# EAGLE schematic bias_board (EAGLE 6.4)

## Sheet 1 of 5: PI_Conn_Isolation
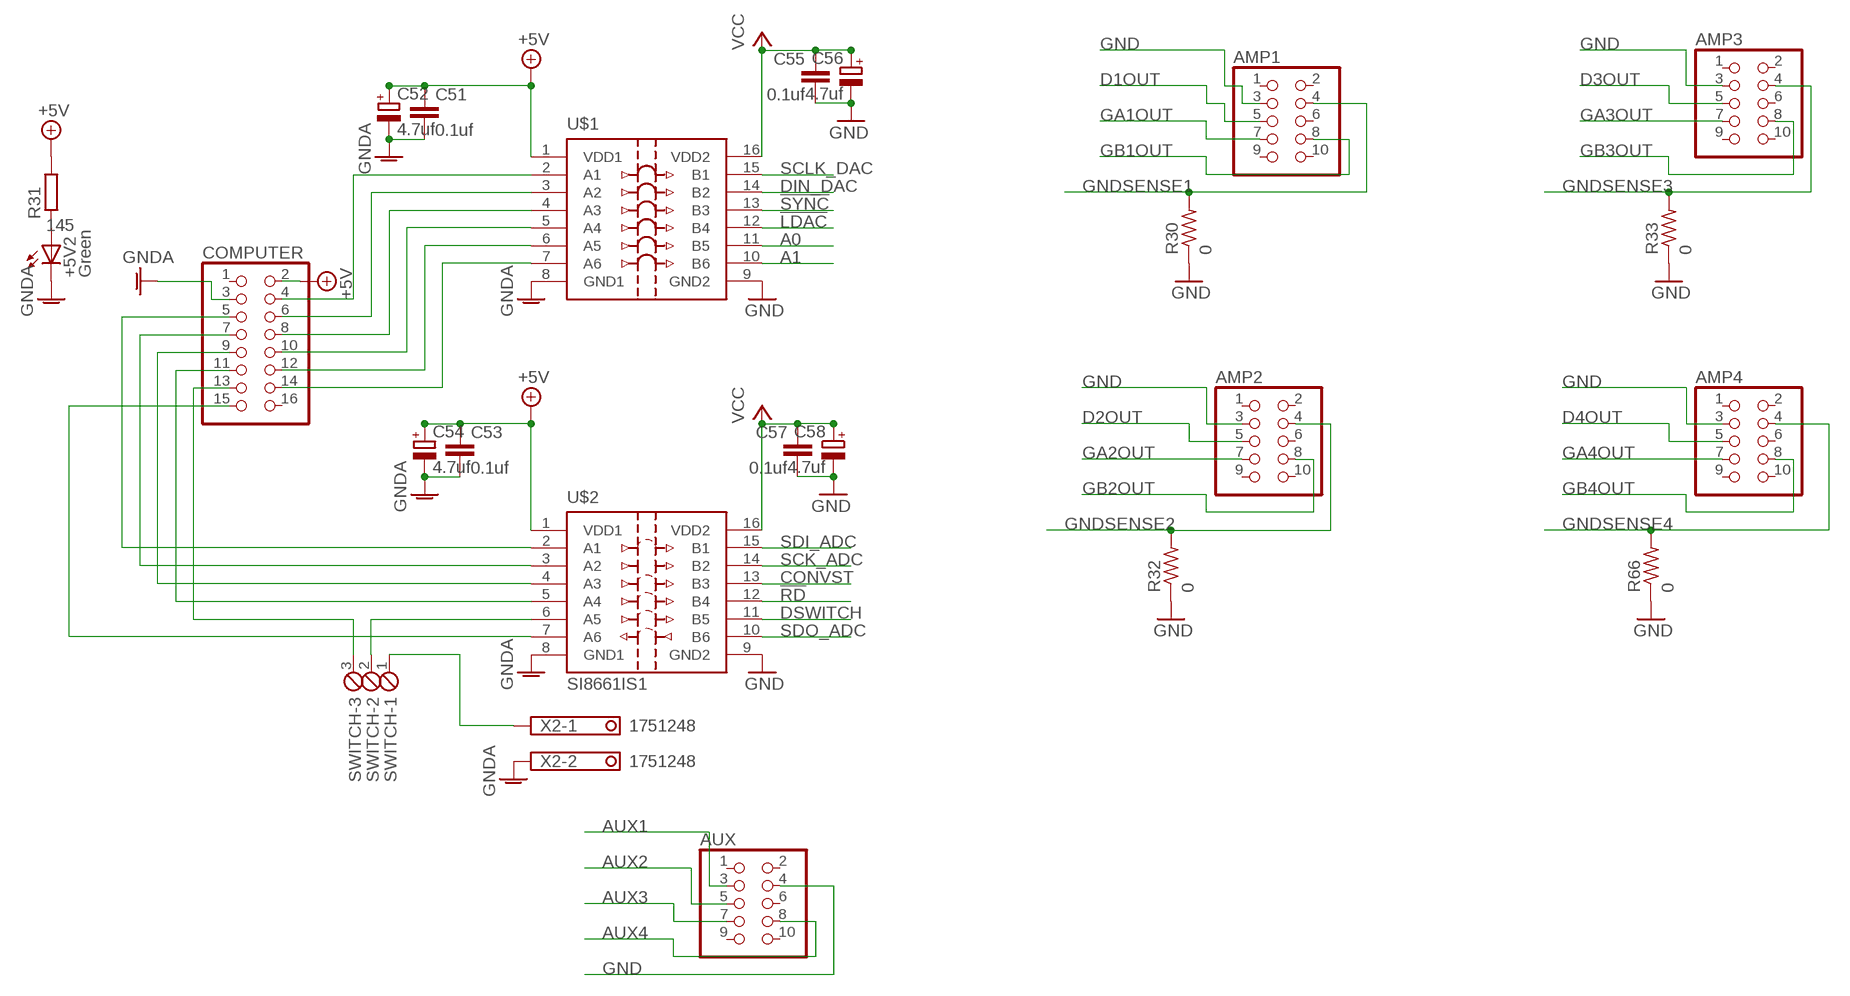
[diagram p0: schematic, sheet 1]

### Parts
+5V2  Green  LEDSMT1206  [1206]
AMP1  PINHD-2X5  [2X05]
AMP2  PINHD-2X5  [2X05]
AMP3  PINHD-2X5  [2X05]
AMP4  PINHD-2X5  [2X05]
AUX  PINHD-2X5  [2X05]
C51  0.1uf  C-EUC1206  [C1206]
C52  4.7uf  CPOL-EUA/3216-18W  [A/3216-18W]
C53  0.1uf  C-EUC1206  [C1206]
C54  4.7uf  CPOL-EUA/3216-18W  [A/3216-18W]
C55  0.1uf  C-EUC1206  [C1206]
C56  4.7uf  CPOL-EUA/3216-18W  [A/3216-18W]
C57  0.1uf  C-EUC1206  [C1206]
C58  4.7uf  CPOL-EUA/3216-18W  [A/3216-18W]
COMPUTER  PINHD-2X8  [2X08]
R30  0  R-US_M1206  [M1206]
R31  145  R-EU_R1206  [R1206]
R32  0  R-US_M1206  [M1206]
R33  0  R-US_M1206  [M1206]
R66  0  R-US_M1206  [M1206]
SWITCH  MPT3  [3POL254]
U$1  SI8660IS1  [SO16]
U$2  SI8661IS1  [SO16]
X2  1751248  [1751248]

### Nets
!LDAC: U$1.12(B4) ; also sheet 3
!RD: U$2.12(B4) ; also sheet 3
!SYNC: U$1.13(B3) ; also sheet 3
+5V: C51.1 C52.+ C53.1 C54.+ COMPUTER.2 R31.2 U$1.1(VDD1) U$2.1(VDD1)
A0: U$1.11(B5) ; also sheet 5
A1: U$1.10(B6) ; also sheet 5
AUX1: AUX.3 ; also sheet 5
AUX2: AUX.5 ; also sheet 5
AUX3: AUX.7 ; also sheet 5
AUX4: AUX.8 ; also sheet 5
CONVST: U$2.13(B3) ; also sheet 3
D1OUT: AMP1.5 ; also sheet 4
D2OUT: AMP2.5 ; also sheet 4
D3OUT: AMP3.5 ; also sheet 4
D4OUT: AMP4.5 ; also sheet 4
DIN_DAC: U$1.14(B2) ; also sheet 3
DSWITCH: U$2.11(B5) ; also sheet 3
GA1OUT: AMP1.7 ; also sheet 4
GA2OUT: AMP2.7 ; also sheet 4
GA3OUT: AMP3.7 ; also sheet 4
GA4OUT: AMP4.7 ; also sheet 4
GB1OUT: AMP1.8 ; also sheet 4
GB2OUT: AMP2.8 ; also sheet 4
GB3OUT: AMP3.8 ; also sheet 4
GB4OUT: AMP4.8 ; also sheet 4
GND: AMP1.3 AMP2.3 AMP3.3 AMP4.3 AUX.4 C55.2 C56.- C57.2 C58.- R30.1 R32.1 R33.1 R66.1 U$1.9(GND2) U$2.9(GND2) ; also sheet 2,3,4,5
GNDA: +5V2.C C51.2 C52.- C53.2 C54.- COMPUTER.3 U$1.8(GND1) U$2.8(GND1) X2.2
GNDSENSE1: AMP1.4 R30.2 ; also sheet 5
GNDSENSE2: AMP2.4 R32.2 ; also sheet 5
GNDSENSE3: AMP3.4 R33.2 ; also sheet 5
GNDSENSE4: AMP4.4 R66.2 ; also sheet 5
N$2: COMPUTER.10 U$1.5(A4)
N$3: COMPUTER.12 U$1.6(A5)
N$18: COMPUTER.11 U$2.5(A4)
N$19: COMPUTER.4 U$1.2(A1)
N$20: COMPUTER.6 U$1.3(A2)
N$21: COMPUTER.8 U$1.4(A3)
N$22: COMPUTER.5 U$2.2(A1)
N$23: COMPUTER.7 U$2.3(A2)
N$24: COMPUTER.9 U$2.4(A3)
N$25: COMPUTER.13 SWITCH.3
N$29: COMPUTER.15 U$2.7(A6)
N$30: +5V2.A R31.1
N$31: SWITCH.2 U$2.6(A5)
N$32: SWITCH.1 X2.1
N$50: COMPUTER.14 U$1.7(A6)
SCK_ADC: U$2.14(B2) ; also sheet 3
SCLK_DAC: U$1.15(B1) ; also sheet 3
SDI_ADC: U$2.15(B1) ; also sheet 3
SDO_ADC: U$2.10(B6) ; also sheet 3
VCC: C55.1 C56.+ C57.1 C58.+ U$1.16(VDD2) U$2.16(VDD2) ; also sheet 2,3,5
Unconnected: AMP1.1 AMP1.2 AMP1.6 AMP1.9 AMP1.10 AMP2.1 AMP2.2 AMP2.6 AMP2.9 AMP2.10 AMP3.1 AMP3.2 AMP3.6 AMP3.9 AMP3.10 AMP4.1 AMP4.2 AMP4.6 AMP4.9 AMP4.10 AUX.1 AUX.2 AUX.6 AUX.9 AUX.10 COMPUTER.1 COMPUTER.16

## Sheet 2 of 5: Power
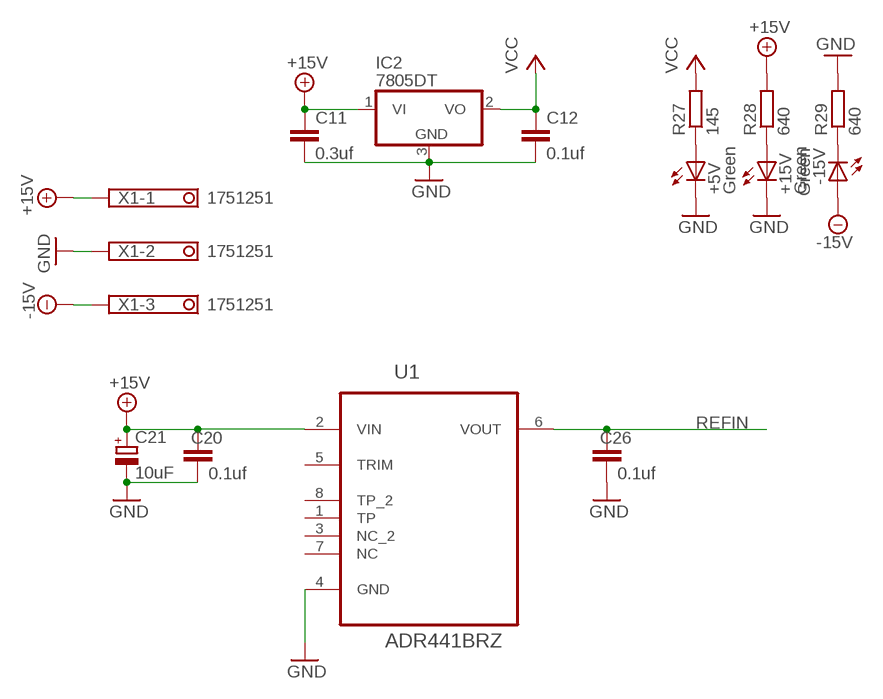
[diagram p1: schematic, sheet 2]

### Parts
+5V  Green  LEDSMT1206  [1206]
+15V  Green  LEDSMT1206  [1206]
-15V  Green  LEDSMT1206  [1206]
C11  0.3uf  C-EUC1206  [C1206]
C12  0.1uf  C-EUC1206  [C1206]
C20  0.1uf  C-EUC1206  [C1206]
C21  10uF  CPOL-EUA/3216-18W  [A/3216-18W]
C26  0.1uf  C-EUC1206  [C1206]
IC2  7805DT  [TO252]
R27  145  R-EU_R1206  [R1206]
R28  640  R-EU_R1206  [R1206]
R29  640  R-EU_R1206  [R1206]
U1  ADR441BRZ  [SOIC127P600X175-8N]
X1  1751251  [1751251]

### Nets
+15V: C11.1 C20.1 C21.+ IC2.1(VI) R28.2 U1.2(VIN) X1.1 ; also sheet 3,4,5
-15V: -15V.A X1.3 ; also sheet 3,4,5
GND: +5V.C +15V.C C11.2 C12.2 C20.2 C21.- C26.2 IC2.3(GND) R29.2 U1.4(GND) X1.2 ; also sheet 1,3,4,5
N$26: +5V.A R27.1
N$27: +15V.A R28.1
N$28: -15V.C R29.1
REFIN: C26.1 U1.6(VOUT) ; also sheet 3
VCC: C12.1 IC2.2(VO) R27.2 ; also sheet 1,3,5
Unconnected: U1.1(TP) U1.3(NC_2) U1.5(TRIM) U1.7(NC) U1.8(TP_2)

## Sheet 3 of 5: DAQ
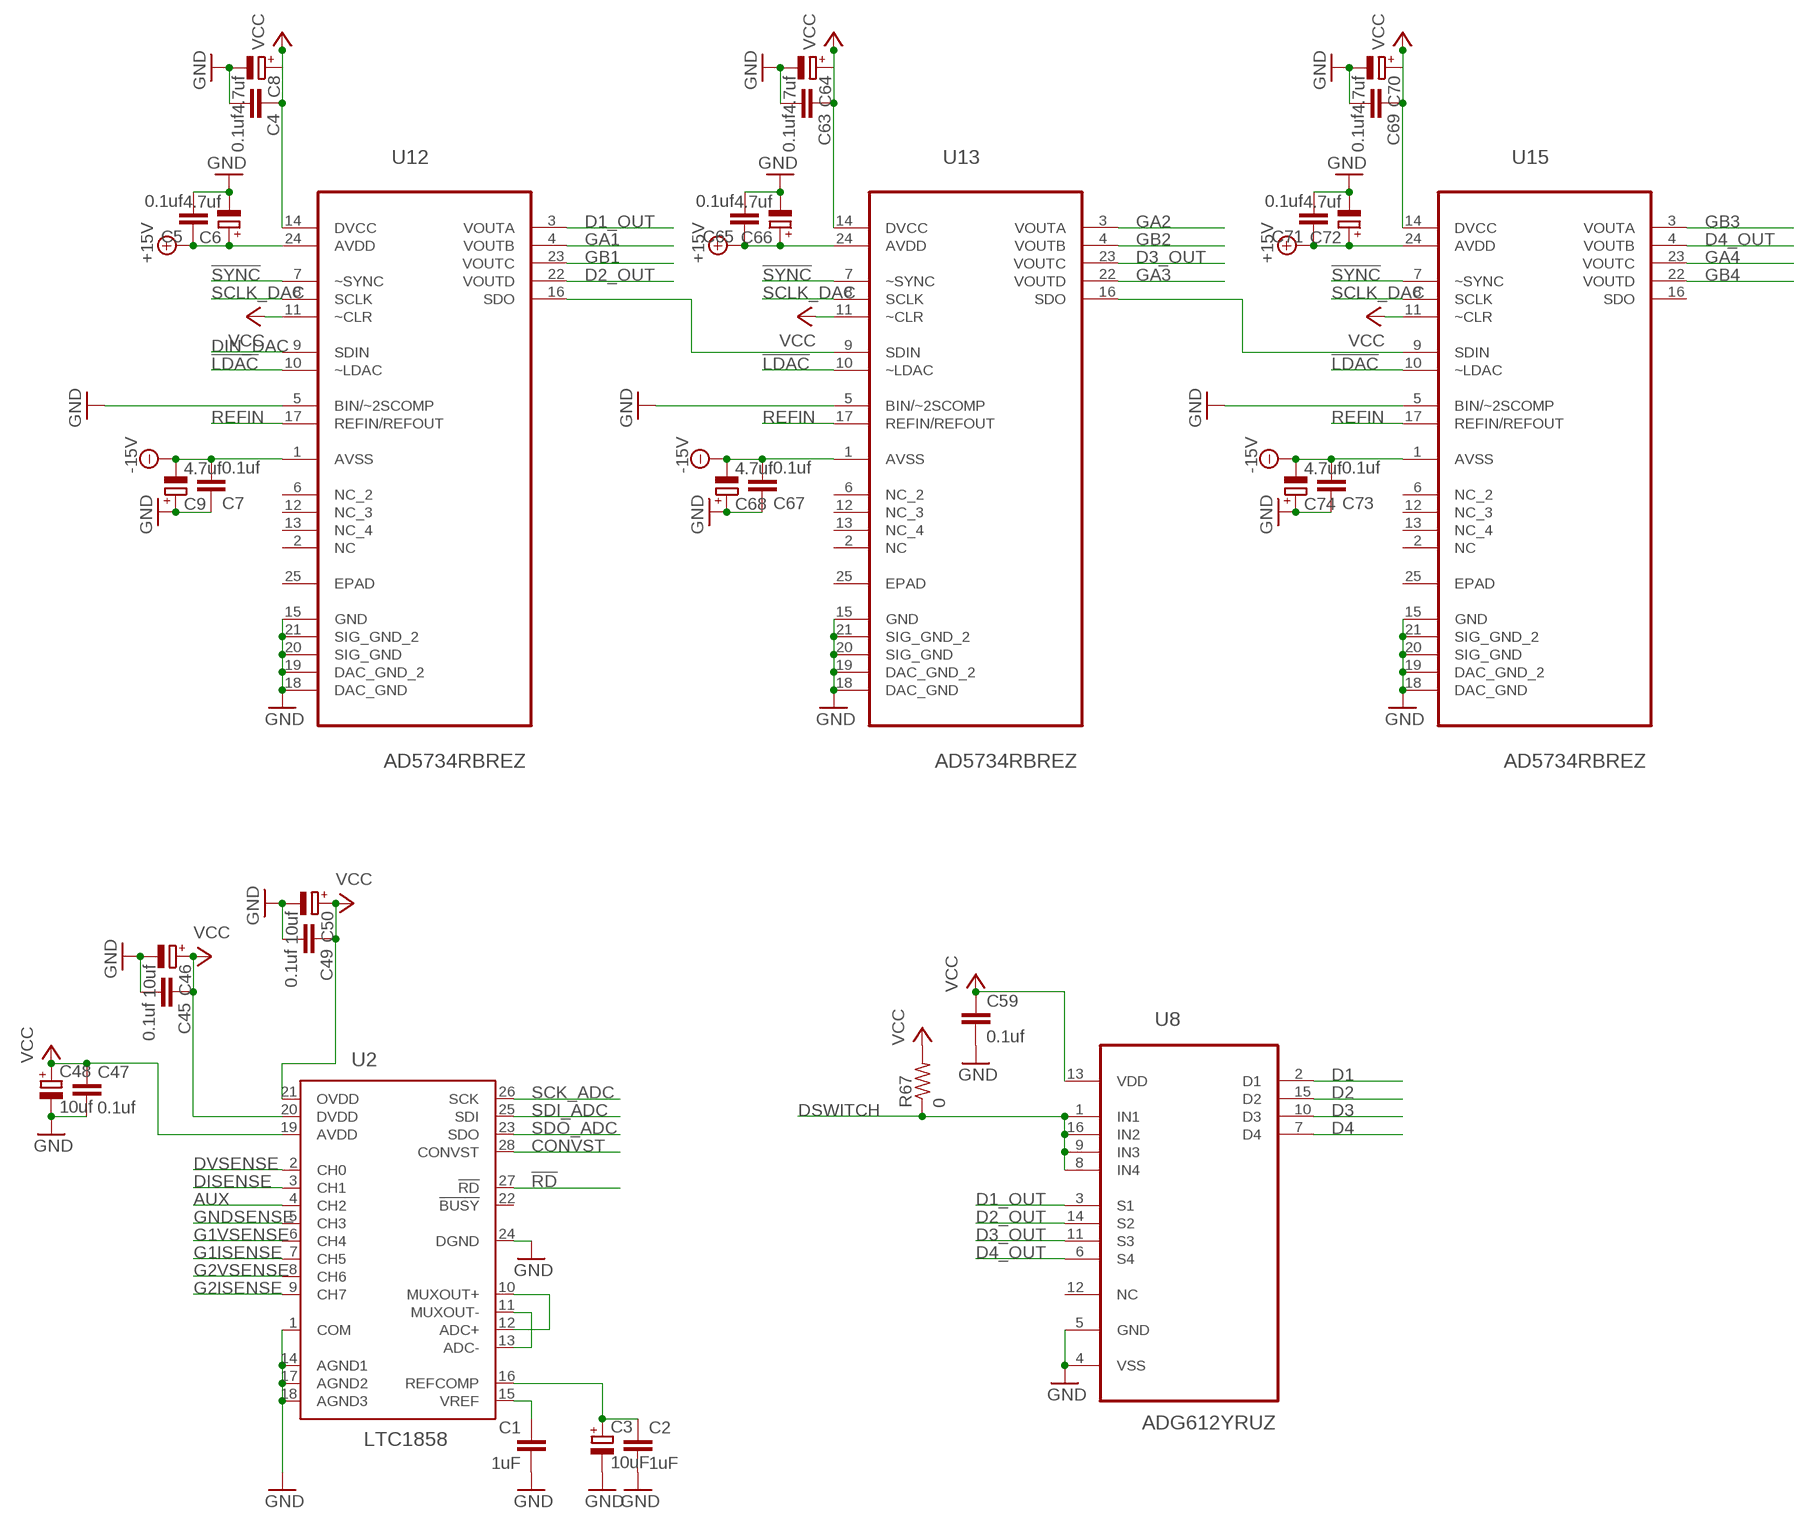
[diagram p2: schematic, sheet 3]

### Parts
C1  1uF  C-EUC1206  [C1206]
C2  1uF  C-EUC1206  [C1206]
C3  10uF  CPOL-EUA/3216-18W  [A/3216-18W]
C4  0.1uf  C-EUC1206  [C1206]
C5  0.1uf  C-EUC1206  [C1206]
C6  4.7uf  CPOL-EUA/3216-18W  [A/3216-18W]
C7  0.1uf  C-EUC1206  [C1206]
C8  4.7uf  CPOL-EUA/3216-18W  [A/3216-18W]
C9  4.7uf  CPOL-EUA/3216-18W  [A/3216-18W]
C45  0.1uf  C-EUC1206  [C1206]
C46  10uf  CPOL-EUA/3216-18W  [A/3216-18W]
C47  0.1uf  C-EUC1206  [C1206]
C48  10uf  CPOL-EUA/3216-18W  [A/3216-18W]
C49  0.1uf  C-EUC1206  [C1206]
C50  10uf  CPOL-EUA/3216-18W  [A/3216-18W]
C59  0.1uf  C-EUC1206  [C1206]
C63  0.1uf  C-EUC1206  [C1206]
C64  4.7uf  CPOL-EUA/3216-18W  [A/3216-18W]
C65  0.1uf  C-EUC1206  [C1206]
C66  4.7uf  CPOL-EUA/3216-18W  [A/3216-18W]
C67  0.1uf  C-EUC1206  [C1206]
C68  4.7uf  CPOL-EUA/3216-18W  [A/3216-18W]
C69  0.1uf  C-EUC1206  [C1206]
C70  4.7uf  CPOL-EUA/3216-18W  [A/3216-18W]
C71  0.1uf  C-EUC1206  [C1206]
C72  4.7uf  CPOL-EUA/3216-18W  [A/3216-18W]
C73  0.1uf  C-EUC1206  [C1206]
C74  4.7uf  CPOL-EUA/3216-18W  [A/3216-18W]
R67  0  R-US_M1206  [M1206]
U2  LTC1858  [SSOP28]
U8  ADG612YRUZ  [SOP65P640X120-16N]
U12  AD5734RBREZ  [SOP65P640X120-25N]
U13  AD5734RBREZ  [SOP65P640X120-25N]
U15  AD5734RBREZ  [SOP65P640X120-25N]

### Nets
!LDAC: U12.10(~LDAC) U13.10(~LDAC) U15.10(~LDAC) ; also sheet 1
!RD: U2.27(!RD) ; also sheet 1
!SYNC: U12.7(~SYNC) U13.7(~SYNC) U15.7(~SYNC) ; also sheet 1
+15V: C5.1 C6.+ C65.1 C66.+ C71.1 C72.+ U12.24(AVDD) U13.24(AVDD) U15.24(AVDD) ; also sheet 2,4,5
-15V: C7.2 C9.- C67.2 C68.- C73.2 C74.- U12.1(AVSS) U13.1(AVSS) U15.1(AVSS) ; also sheet 2,4,5
AUX: U2.4(CH2) ; also sheet 5
CONVST: U2.28(CONVST) ; also sheet 1
D1: U8.2(D1) ; also sheet 4
D1_OUT: U8.3(S1) U12.3(VOUTA)
D2: U8.15(D2) ; also sheet 4
D2_OUT: U8.14(S2) U12.22(VOUTD)
D3: U8.10(D3) ; also sheet 4
D3_OUT: U8.11(S3) U13.23(VOUTC)
D4: U8.7(D4) ; also sheet 4
D4_OUT: U8.6(S4) U15.4(VOUTB)
DIN_DAC: U12.9(SDIN) ; also sheet 1
DISENSE: U2.3(CH1) ; also sheet 5
DSWITCH: R67.1 U8.1(IN1) U8.8(IN4) U8.9(IN3) U8.16(IN2) ; also sheet 1
DVSENSE: U2.2(CH0) ; also sheet 5
G1ISENSE: U2.7(CH5) ; also sheet 5
G1VSENSE: U2.6(CH4) ; also sheet 5
G2ISENSE: U2.9(CH7) ; also sheet 5
G2VSENSE: U2.8(CH6) ; also sheet 5
GA1: U12.4(VOUTB) ; also sheet 4
GA2: U13.3(VOUTA) ; also sheet 4
GA3: U13.22(VOUTD) ; also sheet 4
GA4: U15.23(VOUTC) ; also sheet 4
GB1: U12.23(VOUTC) ; also sheet 4
GB2: U13.4(VOUTB) ; also sheet 4
GB3: U15.3(VOUTA) ; also sheet 4
GB4: U15.22(VOUTD) ; also sheet 4
GND: C1.2 C2.2 C3.- C4.2 C5.2 C6.- C7.1 C8.- C9.+ C45.2 C46.- C47.2 C48.- C49.2 C50.- C59.2 C63.2 C64.- C65.2 C66.- C67.1 C68.+ C69.2 C70.- C71.2 C72.- C73.1 C74.+ U2.1(COM) U2.14(AGND1) U2.17(AGND2) U2.18(AGND3) U2.24(DGND) U8.4(VSS) U8.5(GND) U12.5(BIN/~2SCOMP) U12.15(GND) U12.18(DAC_GND) U12.19(DAC_GND_2) U12.20(SIG_GND) U12.21(SIG_GND_2) U13.5(BIN/~2SCOMP) U13.15(GND) U13.18(DAC_GND) U13.19(DAC_GND_2) U13.20(SIG_GND) U13.21(SIG_GND_2) U15.5(BIN/~2SCOMP) U15.15(GND) U15.18(DAC_GND) U15.19(DAC_GND_2) U15.20(SIG_GND) U15.21(SIG_GND_2) ; also sheet 1,2,4,5
GNDSENSE: U2.5(CH3) ; also sheet 5
N$4: C1.1 U2.15(VREF)
N$5: C2.1 C3.+ U2.16(REFCOMP)
N$13: U2.10(MUXOUT+) U2.12(ADC+)
N$14: U2.11(MUXOUT-) U2.13(ADC-)
N$34: U12.16(SDO) U13.9(SDIN)
N$35: U13.16(SDO) U15.9(SDIN)
REFIN: U12.17(REFIN/REFOUT) U13.17(REFIN/REFOUT) U15.17(REFIN/REFOUT) ; also sheet 2
SCK_ADC: U2.26(SCK) ; also sheet 1
SCLK_DAC: U12.8(SCLK) U13.8(SCLK) U15.8(SCLK) ; also sheet 1
SDI_ADC: U2.25(SDI) ; also sheet 1
SDO_ADC: U2.23(SDO) ; also sheet 1
VCC: C4.1 C8.+ C45.1 C46.+ C47.1 C48.+ C49.1 C50.+ C59.1 C63.1 C64.+ C69.1 C70.+ R67.2 U2.19(AVDD) U2.20(DVDD) U2.21(OVDD) U8.13(VDD) U12.11(~CLR) U12.14(DVCC) U13.11(~CLR) U13.14(DVCC) U15.11(~CLR) U15.14(DVCC) ; also sheet 1,2,5
Unconnected: U2.22(!BUSY) U8.12(NC) U12.2(NC) U12.6(NC_2) U12.12(NC_3) U12.13(NC_4) U13.2(NC) U13.6(NC_2) U13.12(NC_3) U13.13(NC_4) U15.2(NC) U15.6(NC_2) U15.12(NC_3) U15.13(NC_4) U15.16(SDO)

## Sheet 4 of 5: Analog
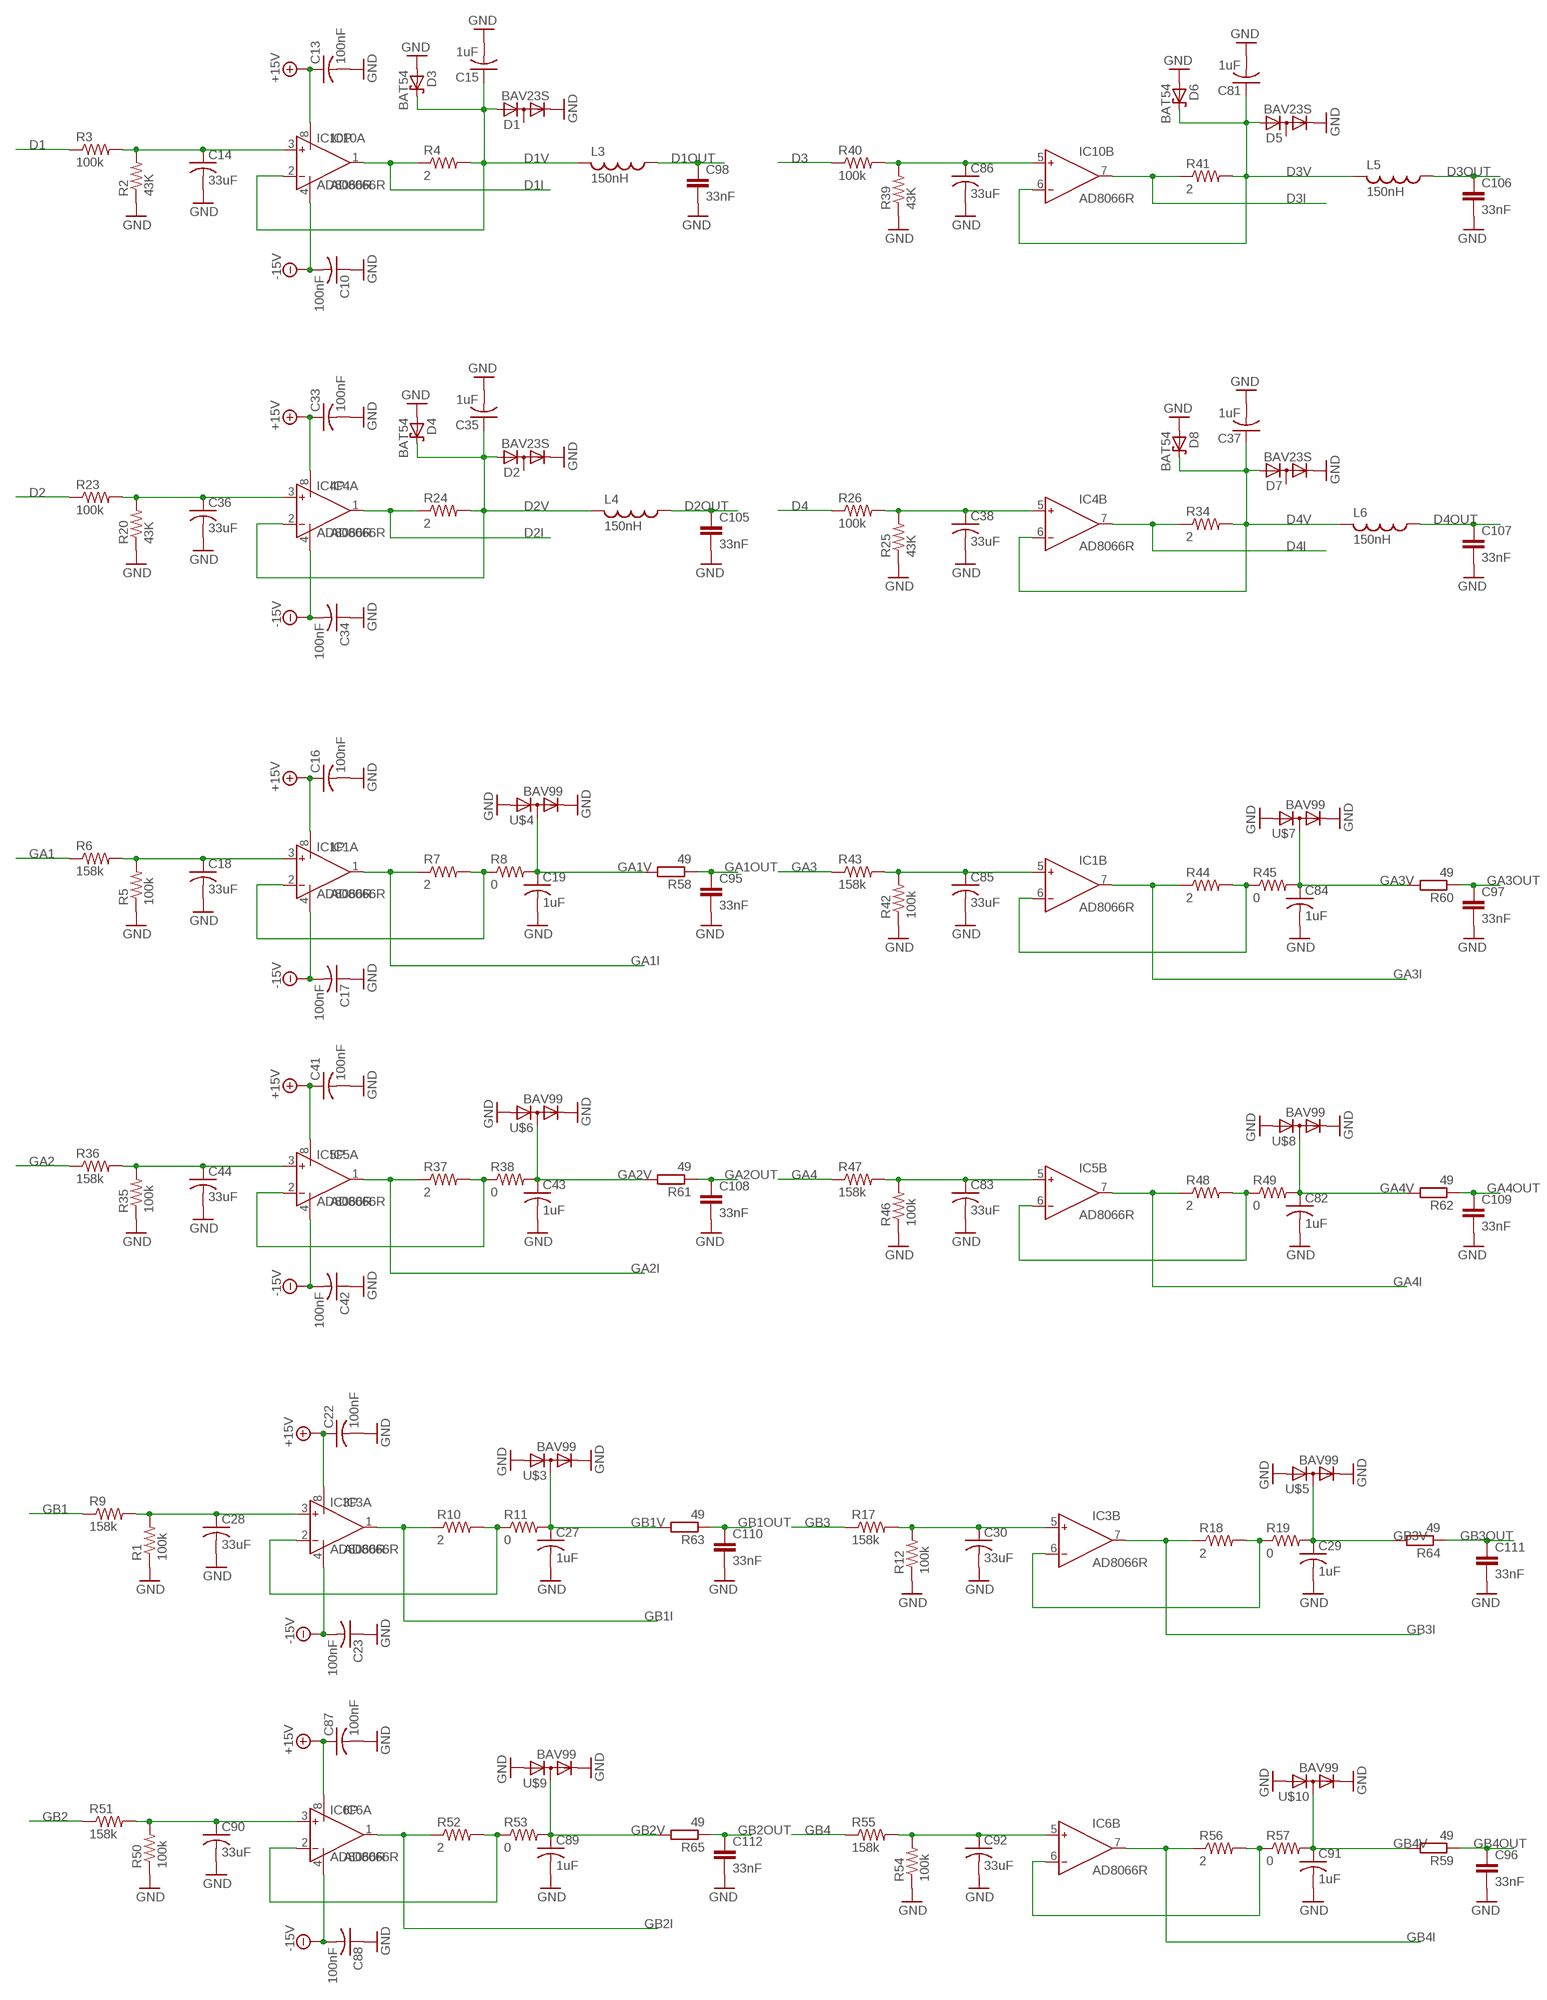
[diagram p3: schematic, sheet 4]

### Parts
C10  100nF  C-USC1206K  [C1206K]
C13  100nF  C-USC1206K  [C1206K]
C14  33uF  C-USC1206K  [C1206K]
C15  1uF  C-USC1206K  [C1206K]
C16  100nF  C-USC1206K  [C1206K]
C17  100nF  C-USC1206K  [C1206K]
C18  33uF  C-USC1206K  [C1206K]
C19  1uF  C-USC1206K  [C1206K]
C22  100nF  C-USC1206K  [C1206K]
C23  100nF  C-USC1206K  [C1206K]
C27  1uF  C-USC1206K  [C1206K]
C28  33uF  C-USC1206K  [C1206K]
C29  1uF  C-USC1206K  [C1206K]
C30  33uF  C-USC1206K  [C1206K]
C33  100nF  C-USC1206K  [C1206K]
C34  100nF  C-USC1206K  [C1206K]
C35  1uF  C-USC1206K  [C1206K]
C36  33uF  C-USC1206K  [C1206K]
C37  1uF  C-USC1206K  [C1206K]
C38  33uF  C-USC1206K  [C1206K]
C41  100nF  C-USC1206K  [C1206K]
C42  100nF  C-USC1206K  [C1206K]
C43  1uF  C-USC1206K  [C1206K]
C44  33uF  C-USC1206K  [C1206K]
C81  1uF  C-USC1206K  [C1206K]
C82  1uF  C-USC1206K  [C1206K]
C83  33uF  C-USC1206K  [C1206K]
C84  1uF  C-USC1206K  [C1206K]
C85  33uF  C-USC1206K  [C1206K]
C86  33uF  C-USC1206K  [C1206K]
C87  100nF  C-USC1206K  [C1206K]
C88  100nF  C-USC1206K  [C1206K]
C89  1uF  C-USC1206K  [C1206K]
C90  33uF  C-USC1206K  [C1206K]
C91  1uF  C-USC1206K  [C1206K]
C92  33uF  C-USC1206K  [C1206K]
C95  33nF  C-EUC1206  [C1206]
C96  33nF  C-EUC1206  [C1206]
C97  33nF  C-EUC1206  [C1206]
C98  33nF  C-EUC1206  [C1206]
C105  33nF  C-EUC1206  [C1206]
C106  33nF  C-EUC1206  [C1206]
C107  33nF  C-EUC1206  [C1206]
C108  33nF  C-EUC1206  [C1206]
C109  33nF  C-EUC1206  [C1206]
C110  33nF  C-EUC1206  [C1206]
C111  33nF  C-EUC1206  [C1206]
C112  33nF  C-EUC1206  [C1206]
D1  BAV23S  [SOT23]
D2  BAV23S  [SOT23]
D3  BAT54  [SOT23]
D4  BAT54  [SOT23]
D5  BAV23S  [SOT23]
D6  BAT54  [SOT23]
D7  BAV23S  [SOT23]
D8  BAT54  [SOT23]
IC1  AD8066R  [SO8]
IC3  AD8066R  [SO8]
IC4  AD8066R  [SO8]
IC5  AD8066R  [SO8]
IC6  AD8066R  [SO8]
IC10  AD8066R  [SO8]
L3  150nH  L-USL3225M  [L3225M]
L4  150nH  L-USL3225M  [L3225M]
L5  150nH  L-USL3225M  [L3225M]
L6  150nH  L-USL3225M  [L3225M]
R1  100k  R-US_M1206  [M1206]
R2  43K  R-US_M1206  [M1206]
R3  100k  R-US_M1206  [M1206]
R4  2  R-US_M1206  [M1206]
R5  100k  R-US_M1206  [M1206]
R6  158k  R-US_M1206  [M1206]
R7  2  R-US_M1206  [M1206]
R8  0  R-US_M1206  [M1206]
R9  158k  R-US_M1206  [M1206]
R10  2  R-US_M1206  [M1206]
R11  0  R-US_M1206  [M1206]
R12  100k  R-US_M1206  [M1206]
R17  158k  R-US_M1206  [M1206]
R18  2  R-US_M1206  [M1206]
R19  0  R-US_M1206  [M1206]
R20  43K  R-US_M1206  [M1206]
R23  100k  R-US_M1206  [M1206]
R24  2  R-US_M1206  [M1206]
R25  43K  R-US_M1206  [M1206]
R26  100k  R-US_M1206  [M1206]
R34  2  R-US_M1206  [M1206]
R35  100k  R-US_M1206  [M1206]
R36  158k  R-US_M1206  [M1206]
R37  2  R-US_M1206  [M1206]
R38  0  R-US_M1206  [M1206]
R39  43K  R-US_M1206  [M1206]
R40  100k  R-US_M1206  [M1206]
R41  2  R-US_M1206  [M1206]
R42  100k  R-US_M1206  [M1206]
R43  158k  R-US_M1206  [M1206]
R44  2  R-US_M1206  [M1206]
R45  0  R-US_M1206  [M1206]
R46  100k  R-US_M1206  [M1206]
R47  158k  R-US_M1206  [M1206]
R48  2  R-US_M1206  [M1206]
R49  0  R-US_M1206  [M1206]
R50  100k  R-US_M1206  [M1206]
R51  158k  R-US_M1206  [M1206]
R52  2  R-US_M1206  [M1206]
R53  0  R-US_M1206  [M1206]
R54  100k  R-US_M1206  [M1206]
R55  158k  R-US_M1206  [M1206]
R56  2  R-US_M1206  [M1206]
R57  0  R-US_M1206  [M1206]
R58  49  R-EU_R1206  [R1206]
R59  49  R-EU_R1206  [R1206]
R60  49  R-EU_R1206  [R1206]
R61  49  R-EU_R1206  [R1206]
R62  49  R-EU_R1206  [R1206]
R63  49  R-EU_R1206  [R1206]
R64  49  R-EU_R1206  [R1206]
R65  49  R-EU_R1206  [R1206]
U$3  BAV99  [SOT23]
U$4  BAV99  [SOT23]
U$5  BAV99  [SOT23]
U$6  BAV99  [SOT23]
U$7  BAV99  [SOT23]
U$8  BAV99  [SOT23]
U$9  BAV99  [SOT23]
U$10  BAV99  [SOT23]

### Nets
+15V: C13.1 C16.1 C22.1 C33.1 C41.1 C87.1 IC1.8(P:V+) IC3.8(P:V+) IC4.8(P:V+) IC5.8(P:V+) IC6.8(P:V+) IC10.8(P:V+) ; also sheet 2,3,5
-15V: C10.2 C17.2 C23.2 C34.2 C42.2 C88.2 IC1.4(P:V-) IC3.4(P:V-) IC4.4(P:V-) IC5.4(P:V-) IC6.4(P:V-) IC10.4(P:V-) ; also sheet 2,3,5
D1: R3.1 ; also sheet 3
D1I: IC10.1(A:OUT) R4.1 ; also sheet 5
D1OUT: C98.1 L3.1 ; also sheet 1
D1V: C15.1 D1.1(A) D3.3(C) IC10.2(A:IN-) L3.2 R4.2 ; also sheet 5
D2: R23.1 ; also sheet 3
D2I: IC4.1(A:OUT) R24.1 ; also sheet 5
D2OUT: C105.1 L4.1 ; also sheet 1
D2V: C35.1 D2.1(A) D4.3(C) IC4.2(A:IN-) L4.2 R24.2 ; also sheet 5
D3: R40.1 ; also sheet 3
D3I: IC10.7(B:OUT) R41.1 ; also sheet 5
D3OUT: C106.1 L5.1 ; also sheet 1
D3V: C81.1 D5.1(A) D6.3(C) IC10.6(B:IN-) L5.2 R41.2 ; also sheet 5
D4: R26.1 ; also sheet 3
D4I: IC4.7(B:OUT) R34.1 ; also sheet 5
D4OUT: C107.1 L6.1 ; also sheet 1
D4V: C37.1 D7.1(A) D8.3(C) IC4.6(B:IN-) L6.2 R34.2 ; also sheet 5
GA1: R6.1 ; also sheet 3
GA1I: IC1.1(A:OUT) R7.1 ; also sheet 5
GA1OUT: C95.1 R58.1 ; also sheet 1
GA1V: C19.1 R8.2 R58.2 U$4.3(AC) ; also sheet 5
GA2: R36.1 ; also sheet 3
GA2I: IC5.1(A:OUT) R37.1 ; also sheet 5
GA2OUT: C108.1 R61.1 ; also sheet 1
GA2V: C43.1 R38.2 R61.2 U$6.3(AC) ; also sheet 5
GA3: R43.1 ; also sheet 3
GA3I: IC1.7(B:OUT) R44.1 ; also sheet 5
GA3OUT: C97.1 R60.1 ; also sheet 1
GA3V: C84.1 R45.2 R60.2 U$7.3(AC) ; also sheet 5
GA4: R47.1 ; also sheet 3
GA4I: IC5.7(B:OUT) R48.1 ; also sheet 5
GA4OUT: C109.1 R62.1 ; also sheet 1
GA4V: C82.1 R49.2 R62.2 U$8.3(AC) ; also sheet 5
GB1: R9.1 ; also sheet 3
GB1I: IC3.1(A:OUT) R10.1 ; also sheet 5
GB1OUT: C110.1 R63.1 ; also sheet 1
GB1V: C27.1 R11.2 R63.2 U$3.3(AC) ; also sheet 5
GB2: R51.1 ; also sheet 3
GB2I: IC6.1(A:OUT) R52.1 ; also sheet 5
GB2OUT: C112.1 R65.1 ; also sheet 1
GB2V: C89.1 R53.2 R65.2 U$9.3(AC) ; also sheet 5
GB3: R17.1 ; also sheet 3
GB3I: IC3.7(B:OUT) R18.1 ; also sheet 5
GB3OUT: C111.1 R64.1 ; also sheet 1
GB3V: C29.1 R19.2 R64.2 U$5.3(AC) ; also sheet 5
GB4: R55.1 ; also sheet 3
GB4I: IC6.7(B:OUT) R56.1 ; also sheet 5
GB4OUT: C96.1 R59.1 ; also sheet 1
GB4V: C91.1 R57.2 R59.2 U$10.3(AC) ; also sheet 5
GND: C10.1 C13.2 C14.2 C15.2 C16.2 C17.1 C18.2 C19.2 C22.2 C23.1 C27.2 C28.2 C29.2 C30.2 C33.2 C34.1 C35.2 C36.2 C37.2 C38.2 C41.2 C42.1 C43.2 C44.2 C81.2 C82.2 C83.2 C84.2 C85.2 C86.2 C87.2 C88.1 C89.2 C90.2 C91.2 C92.2 C95.2 C96.2 C97.2 C98.2 C105.2 C106.2 C107.2 C108.2 C109.2 C110.2 C111.2 C112.2 D1.2(C) D2.2(C) D3.1(A) D4.1(A) D5.2(C) D6.1(A) D7.2(C) D8.1(A) R1.1 R2.1 R5.1 R12.1 R20.1 R25.1 R35.1 R39.1 R42.1 R46.1 R50.1 R54.1 U$3.1(A) U$3.2(C) U$4.1(A) U$4.2(C) U$5.1(A) U$5.2(C) U$6.1(A) U$6.2(C) U$7.1(A) U$7.2(C) U$8.1(A) U$8.2(C) U$9.1(A) U$9.2(C) U$10.1(A) U$10.2(C) ; also sheet 1,2,3,5
N$1: C14.1 IC10.3(A:IN+) R2.2 R3.2
N$6: C28.1 IC3.3(A:IN+) R1.2 R9.2
N$7: C18.1 IC1.3(A:IN+) R5.2 R6.2
N$9: IC3.2(A:IN-) R10.2 R11.1
N$10: C30.1 IC3.5(B:IN+) R12.2 R17.2
N$11: IC1.2(A:IN-) R7.2 R8.1
N$12: IC3.6(B:IN-) R18.2 R19.1
N$15: C36.1 IC4.3(A:IN+) R20.2 R23.2
N$16: C38.1 IC4.5(B:IN+) R25.2 R26.2
N$17: C44.1 IC5.3(A:IN+) R35.2 R36.2
N$36: C86.1 IC10.5(B:IN+) R39.2 R40.2
N$37: C85.1 IC1.5(B:IN+) R42.2 R43.2
N$40: IC1.6(B:IN-) R44.2 R45.1
N$41: IC5.2(A:IN-) R37.2 R38.1
N$42: C83.1 IC5.5(B:IN+) R46.2 R47.2
N$43: IC5.6(B:IN-) R48.2 R49.1
N$44: C90.1 IC6.3(A:IN+) R50.2 R51.2
N$45: IC6.2(A:IN-) R52.2 R53.1
N$46: C92.1 IC6.5(B:IN+) R54.2 R55.2
N$47: IC6.6(B:IN-) R56.2 R57.1
Unconnected: D1.3(AC) D2.3(AC) D5.3(AC) D7.3(AC)

## Sheet 5 of 5: M UX
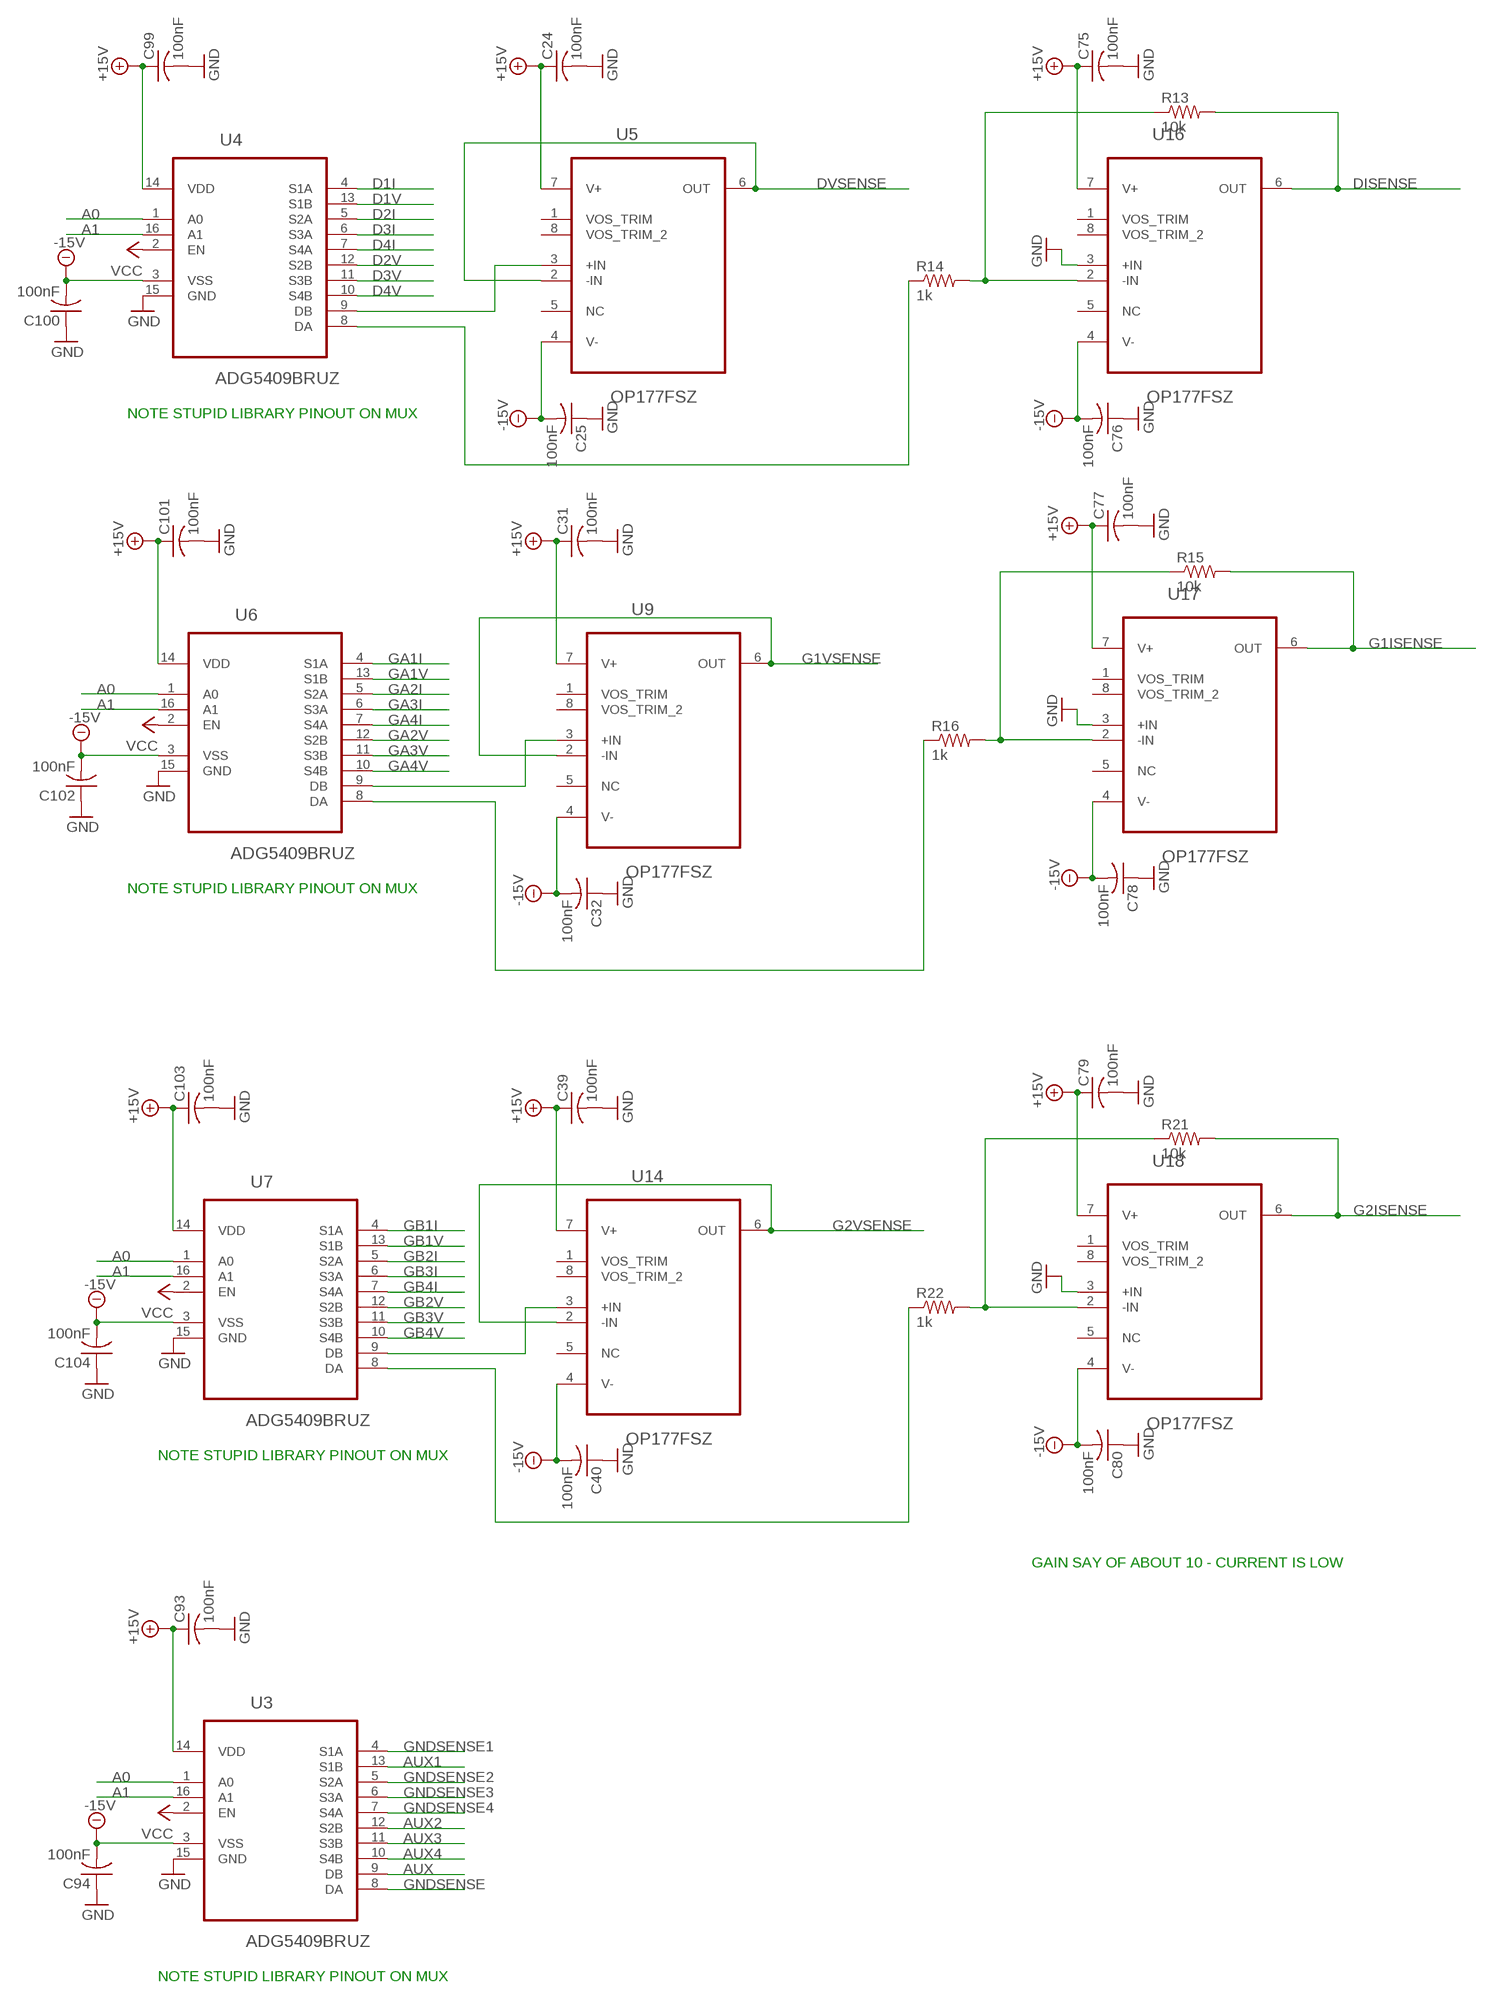
[diagram p4: schematic, sheet 5]

### Parts
C24  100nF  C-USC1206K  [C1206K]
C25  100nF  C-USC1206K  [C1206K]
C31  100nF  C-USC1206K  [C1206K]
C32  100nF  C-USC1206K  [C1206K]
C39  100nF  C-USC1206K  [C1206K]
C40  100nF  C-USC1206K  [C1206K]
C75  100nF  C-USC1206K  [C1206K]
C76  100nF  C-USC1206K  [C1206K]
C77  100nF  C-USC1206K  [C1206K]
C78  100nF  C-USC1206K  [C1206K]
C79  100nF  C-USC1206K  [C1206K]
C80  100nF  C-USC1206K  [C1206K]
C93  100nF  C-USC1206K  [C1206K]
C94  100nF  C-USC1206K  [C1206K]
C99  100nF  C-USC1206K  [C1206K]
C100  100nF  C-USC1206K  [C1206K]
C101  100nF  C-USC1206K  [C1206K]
C102  100nF  C-USC1206K  [C1206K]
C103  100nF  C-USC1206K  [C1206K]
C104  100nF  C-USC1206K  [C1206K]
R13  10k  R-US_M1206  [M1206]
R14  1k  R-US_M1206  [M1206]
R15  10k  R-US_M1206  [M1206]
R16  1k  R-US_M1206  [M1206]
R21  10k  R-US_M1206  [M1206]
R22  1k  R-US_M1206  [M1206]
U3  ADG5409BRUZ  [SOP65P640X120-16N]
U4  ADG5409BRUZ  [SOP65P640X120-16N]
U5  OP177FSZ  [SOIC127P600X175-8N]
U6  ADG5409BRUZ  [SOP65P640X120-16N]
U7  ADG5409BRUZ  [SOP65P640X120-16N]
U9  OP177FSZ  [SOIC127P600X175-8N]
U14  OP177FSZ  [SOIC127P600X175-8N]
U16  OP177FSZ  [SOIC127P600X175-8N]
U17  OP177FSZ  [SOIC127P600X175-8N]
U18  OP177FSZ  [SOIC127P600X175-8N]

### Nets
+15V: C24.1 C31.1 C39.1 C75.1 C77.1 C79.1 C93.1 C99.1 C101.1 C103.1 U3.14(VDD) U4.14(VDD) U5.7(V+) U6.14(VDD) U7.14(VDD) U9.7(V+) U14.7(V+) U16.7(V+) U17.7(V+) U18.7(V+) ; also sheet 2,3,4
-15V: C25.2 C32.2 C40.2 C76.2 C78.2 C80.2 C94.2 C100.2 C102.2 C104.2 U3.3(VSS) U4.3(VSS) U5.4(V-) U6.3(VSS) U7.3(VSS) U9.4(V-) U14.4(V-) U16.4(V-) U17.4(V-) U18.4(V-) ; also sheet 2,3,4
A0: U3.1(A0) U4.1(A0) U6.1(A0) U7.1(A0) ; also sheet 1
A1: U3.16(A1) U4.16(A1) U6.16(A1) U7.16(A1) ; also sheet 1
AUX: U3.9(DB) ; also sheet 3
AUX1: U3.13(S1B) ; also sheet 1
AUX2: U3.12(S2B) ; also sheet 1
AUX3: U3.11(S3B) ; also sheet 1
AUX4: U3.10(S4B) ; also sheet 1
D1I: U4.4(S1A) ; also sheet 4
D1V: U4.13(S1B) ; also sheet 4
D2I: U4.5(S2A) ; also sheet 4
D2V: U4.12(S2B) ; also sheet 4
D3I: U4.6(S3A) ; also sheet 4
D3V: U4.11(S3B) ; also sheet 4
D4I: U4.7(S4A) ; also sheet 4
D4V: U4.10(S4B) ; also sheet 4
DISENSE: R13.2 U16.6(OUT) ; also sheet 3
DVSENSE: U5.2(-IN) U5.6(OUT) ; also sheet 3
G1ISENSE: R15.2 U17.6(OUT) ; also sheet 3
G1V1: U6.9(DB) U9.3(+IN)
G1VSENSE: U9.2(-IN) U9.6(OUT) ; also sheet 3
G2ISENSE: R21.2 U18.6(OUT) ; also sheet 3
G2VSENSE: U14.2(-IN) U14.6(OUT) ; also sheet 3
GA1I: U6.4(S1A) ; also sheet 4
GA1V: U6.13(S1B) ; also sheet 4
GA2I: U6.5(S2A) ; also sheet 4
GA2V: U6.12(S2B) ; also sheet 4
GA3I: U6.6(S3A) ; also sheet 4
GA3V: U6.11(S3B) ; also sheet 4
GA4I: U6.7(S4A) ; also sheet 4
GA4V: U6.10(S4B) ; also sheet 4
GB1I: U7.4(S1A) ; also sheet 4
GB1V: U7.13(S1B) ; also sheet 4
GB2I: U7.5(S2A) ; also sheet 4
GB2V: U7.12(S2B) ; also sheet 4
GB3I: U7.6(S3A) ; also sheet 4
GB3V: U7.11(S3B) ; also sheet 4
GB4I: U7.7(S4A) ; also sheet 4
GB4V: U7.10(S4B) ; also sheet 4
GND: C24.2 C25.1 C31.2 C32.1 C39.2 C40.1 C75.2 C76.1 C77.2 C78.1 C79.2 C80.1 C93.2 C94.1 C99.2 C100.1 C101.2 C102.1 C103.2 C104.1 U3.15(GND) U4.15(GND) U6.15(GND) U7.15(GND) U16.3(+IN) U17.3(+IN) U18.3(+IN) ; also sheet 1,2,3,4
GNDSENSE: U3.8(DA) ; also sheet 3
GNDSENSE1: U3.4(S1A) ; also sheet 1
GNDSENSE2: U3.5(S2A) ; also sheet 1
GNDSENSE3: U3.6(S3A) ; also sheet 1
GNDSENSE4: U3.7(S4A) ; also sheet 1
N$8: R13.1 R14.2 U16.2(-IN)
N$38: R15.1 R16.2 U17.2(-IN)
N$39: R21.1 R22.2 U18.2(-IN)
N$48: U4.9(DB) U5.3(+IN)
N$49: R14.1 U4.8(DA)
N$51: R16.1 U6.8(DA)
N$52: U7.9(DB) U14.3(+IN)
N$53: R22.1 U7.8(DA)
VCC: U3.2(EN) U4.2(EN) U6.2(EN) U7.2(EN) ; also sheet 1,2,3
Unconnected: U5.1(VOS_TRIM) U5.5(NC) U5.8(VOS_TRIM_2) U9.1(VOS_TRIM) U9.5(NC) U9.8(VOS_TRIM_2) U14.1(VOS_TRIM) U14.5(NC) U14.8(VOS_TRIM_2) U16.1(VOS_TRIM) U16.5(NC) U16.8(VOS_TRIM_2) U17.1(VOS_TRIM) U17.5(NC) U17.8(VOS_TRIM_2) U18.1(VOS_TRIM) U18.5(NC) U18.8(VOS_TRIM_2)

### Notes on the sheet
- NOTE STUPID LIBRARY PINOUT ON MUX
- NOTE STUPID LIBRARY PINOUT ON MUX
- NOTE STUPID LIBRARY PINOUT ON MUX
- GAIN SAY OF ABOUT 10 - CURRENT IS LOW
- NOTE STUPID LIBRARY PINOUT ON MUX

## Power pins joined to a net without a drawn wire
EPAD: U12.25(EPAD) U13.25(EPAD) U15.25(EPAD)

## Library data of the parts
+5V +5V2 +15V -15V = led:LED: LED OSRAM: - CHIPLED LG R971, LG N971, LY N971, LG Q971, LY Q971, LO R971, LY R971 LH N974, LH R974 LS Q976, LO Q976, LY Q976 LO Q996 - Hyper CHIPLED LW Q18S LB Q993, LB Q99A, LB R99A - SideLED LS A670, LO A670, LY A670, LG A670, LP A670 LB A673, LV A673, LT A673, LW A673 LH A674 LY A675 LS A676, LA A676, LO A676, LY A676, LW A676 LS A679, LY A679, LG A679 - Hyper Micro SIDELED® LS Y876, LA Y876, LO Y876, LY Y876 LT Y87S - SmartLED LW L88C, LW L88S LB L89C, LB L89S, LG L890 LS L89K, LO L89K, LY L89K LS L896, LA L896, LO L896, LY L896 - TOPLED LS T670, LO T670, LY T670, LG T670, LP T670 LSG T670, LSP T670, LSY T670, LOP T670, LYG T670 LG T671, LOG T671, LSG T671 LB T673, LV T673, LT T673, LW T673 LH T674 LS T676, LA T676, LO T676, LY T676, LB T676, LH T676, LSB T676, LW T676 LB T67C, LV T67C, LT T67C, LS T67K, LO T67K, LY T67K, LW E67C LS E67B, LA E67B, LO E67B, LY E67B, LB E67C, LV E67C, LT E67C LW T67C LS T679, LY T679, LG T679 LS T770, LO T770, LY T770, LG T770, LP T770 LB T773, LV T773, LT T773, LW T773 LH T774 LS E675, LA E675, LY E675, LS T675 LS T776, LA T776, LO T776, LY T776, LB T776 LHGB T686 LT T68C, LB T68C - Hyper Mini TOPLED® LB M676 - Mini TOPLED Santana® LG M470 LS M47K, LO M47K, LY M47K Source: http://www.osram.convergy.de LUXEON: - LUMILED® LXK2-PW12-R00, LXK2-PW12-S00, LXK2-PW14-U00, LXK2-PW14-V00 LXK2-PM12-R00, LXK2-PM12-S00, LXK2-PM14-U00 LXK2-PE12-Q00, LXK2-PE12-R00, LXK2-PE12-S00, LXK2-PE14-T00, LXK2-PE14-U00 LXK2-PB12-K00, LXK2-PB12-L00, LXK2-PB12-M00, LXK2-PB14-N00, LXK2-PB14-P00, LXK2-PB14-Q00 LXK2-PR12-L00, LXK2-PR12-M00, LXK2-PR14-Q00, LXK2-PR14-R00 LXK2-PD12-Q00, LXK2-PD12-R00, LXK2-PD12-S00 LXK2-PH12-R00, LXK2-PH12-S00 LXK2-PL12-P00, LXK2-PL12-Q00, LXK2-PL12-R00 Source: www.luxeon.com KINGBRIGHT: KA-3528ASYC Source: www.kingbright.com; MF: EAO SWITCH CORP.; MPN: 01-901.5; OC_NEWARK: 90B0028
AMP1-AMP4 AUX = pinhead:PINHD-2X5: PIN HEADER
C1 C2 C4 C5 C7 C12 C20 C26 C45 C47 C49 C51 C53 C55 C57 C59 C63 C65 C67 C69 C71 C73 C95-C98 C105-C112 = resistor:C-EU: CAPACITOR, European symbol; OC_NEWARK: unknown; PARTNO: C1206C104K3RACTU
C3 C6 C8 C9 C21 C46 C48 C50 C52 C54 C56 C58 C64 C66 C68 C70 C72 C74 = resistor:CPOL-EU: POLARIZED CAPACITOR, European symbol; OC_NEWARK: unknown; PARTNO: T491A475M025AT
C10 C13-C19 C22-C25 C27-C44 C75-C94 C99-C104 = resistor:C-US: CAPACITOR, American symbol
C11 = resistor:C-EU: CAPACITOR, European symbol; OC_NEWARK: unknown; PARTNO: C3216X7R1E334K
COMPUTER = pinhead:PINHD-2X8: PIN HEADER
D1 D2 D5 D7 = Diodes:BAV23S: DIODE low-leakage double diode
D3 D4 D6 D8 = diode:BAT54: Schottky Diodes Source: Fairchild .. BAT54.pdf
IC1 IC3-IC6 IC10 = analog-devices:AD8066: High Performance, 145 MHz FastFET Op Amps Source: http://www.analog.com/static/imported-files/data_sheets/AD8065_8066.pdf; OC_FARNELL: unknown; OC_NEWARK: unknown
IC2 = linear:78*: Positive VOLTAGE REGULATOR Source: http://cache.national.com/ds/LM/LM78L05.pdf http://www.fairchildsemi.com/ds/LM/LM7805.pdf; OC_NEWARK: unknown; PARTNO: BA17805FP-E2
L3-L6 = rcl:L-US: INDUCTOR, American symbol
R1-R26 R30 R32-R57 R66 R67 = resistor:R-US_: RESISTOR, American symbol
R27 R31 R58-R65 = resistor:R-EU_: RESISTOR, European symbol; MPN: MC0.125W12061%147R; OC_NEWARK: 24W6117
R28 R29 = resistor:R-EU_: RESISTOR, European symbol; MPN: MC0.125W12061%649R; OC_NEWARK: 24W6337
SWITCH = con-phoenix-254:MPT3: PHOENIX CONNECTOR; OC_FARNELL: unknown; OC_NEWARK: unknown
U1 = Analog Devices_By_element14_Batch_1:ADR441BRZ: Ultralow Noise, LDO XFET Voltage References with Current Sink and Source; MPN: ADR441BRZ; OC_FARNELL: 1274158; OC_NEWARK: 19M0716; PACKAGE: SOIC-8; SUPPLIER: ANALOG DEVICES
U2 = linear_technology:LTC1858
U3 U4 U6 U7 = Analog Devices_By_element14_Batch_1:ADG5409BRUZ: High Voltage Latch-Up Proof, 4-/8-Channel Multiplexers; MPN: ADG5409BRUZ; OC_FARNELL: 1864699; OC_NEWARK: 91R2563; PACKAGE: TSSOP-16; SUPPLIER: Analog Devices
U5 U9 U14 U16-U18 = Analog Devices_By_element14_Batch_1:OP177FSZ: Ultraprecision Operational Amplifier; MPN: OP177FSZ; OC_FARNELL: 1651309; OC_NEWARK: 19M8978; PACKAGE: SOIC-8; SUPPLIER: Analog Devices
U8 = ADI-Phase-2:ADG612YRUZ: Quad SPST Switches; MPN: ADG612YRUZ; OC_FARNELL: 1438885; OC_NEWARK: 59K1431; PACKAGE: TSSOP-16; SUPPLIER: Analog Devices
U12 U13 U15 = Analog Devices_By_element14_Batch_1:AD5734RBREZ: DAC; MPN: AD5734RBREZ; OC_FARNELL: 1786048; OC_NEWARK: 51P3753; PACKAGE: TSSOP-24; SUPPLIER: Analog Devices
U$1 = silicon_image:SI8660: Si8460 6 Channel (6/0) Digital Isolator Silicon Labs Si84xx ISOpro digital isolator series. The Si84xx ISOpro digital isolators provide low power galvanic isolation for digital signals. They come in speeds of 1Mbps and 150Mbps, and isolation ratings of 1KV, 2.5KV and 5KV. The independent sides use 2.7-5.5V supplies and draw under 5mA per channel. Donald Becker
U$2 = silicon_image:SI8661: Si8461 6 Channel (5/1) Digital Isolator Silicon Labs Si84xx ISOpro digital isolator series. The Si84xx ISOpro digital isolators provide low power galvanic isolation for digital signals. They come in speeds of 1Mbps and 150Mbps, and isolation ratings of 1KV, 2.5KV and 5KV. The independent sides use 2.7-5.5V supplies and draw under 5mA per channel. Donald Becker
U$3-U$10 = Diodes:BAV99
X1 = con-phoenix-350:1751251: MKDS 1/ 3-3,5 Printklemme Nennstrom: 10 A Bemessungsspannung: 160 V Raster: 3,5 mm Polzahl: 3 Montageart: Löten Anschlussart: Schraubanschluss Anschlussrichtung vom Leiter zur Platine: 0° Source: http://eshop.phoenixcontact.com .. 1751251.pdf; OC_FARNELL: unknown; OC_NEWARK: unknown
X2 = con-phoenix-350:1751248: MKDS 1/ 2-3,5 Printklemme Nennstrom: 10 A Bemessungsspannung: 160 V Raster: 3,5 mm Polzahl: 2 Montageart: Löten Anschlussart: Schraubanschluss Anschlussrichtung vom Leiter zur Platine: 0° Source: http://eshop.phoenixcontact.com .. 1751248.pdf; OC_FARNELL: unknown; OC_NEWARK: unknown